# Altium project F4Test2.PrjPcb
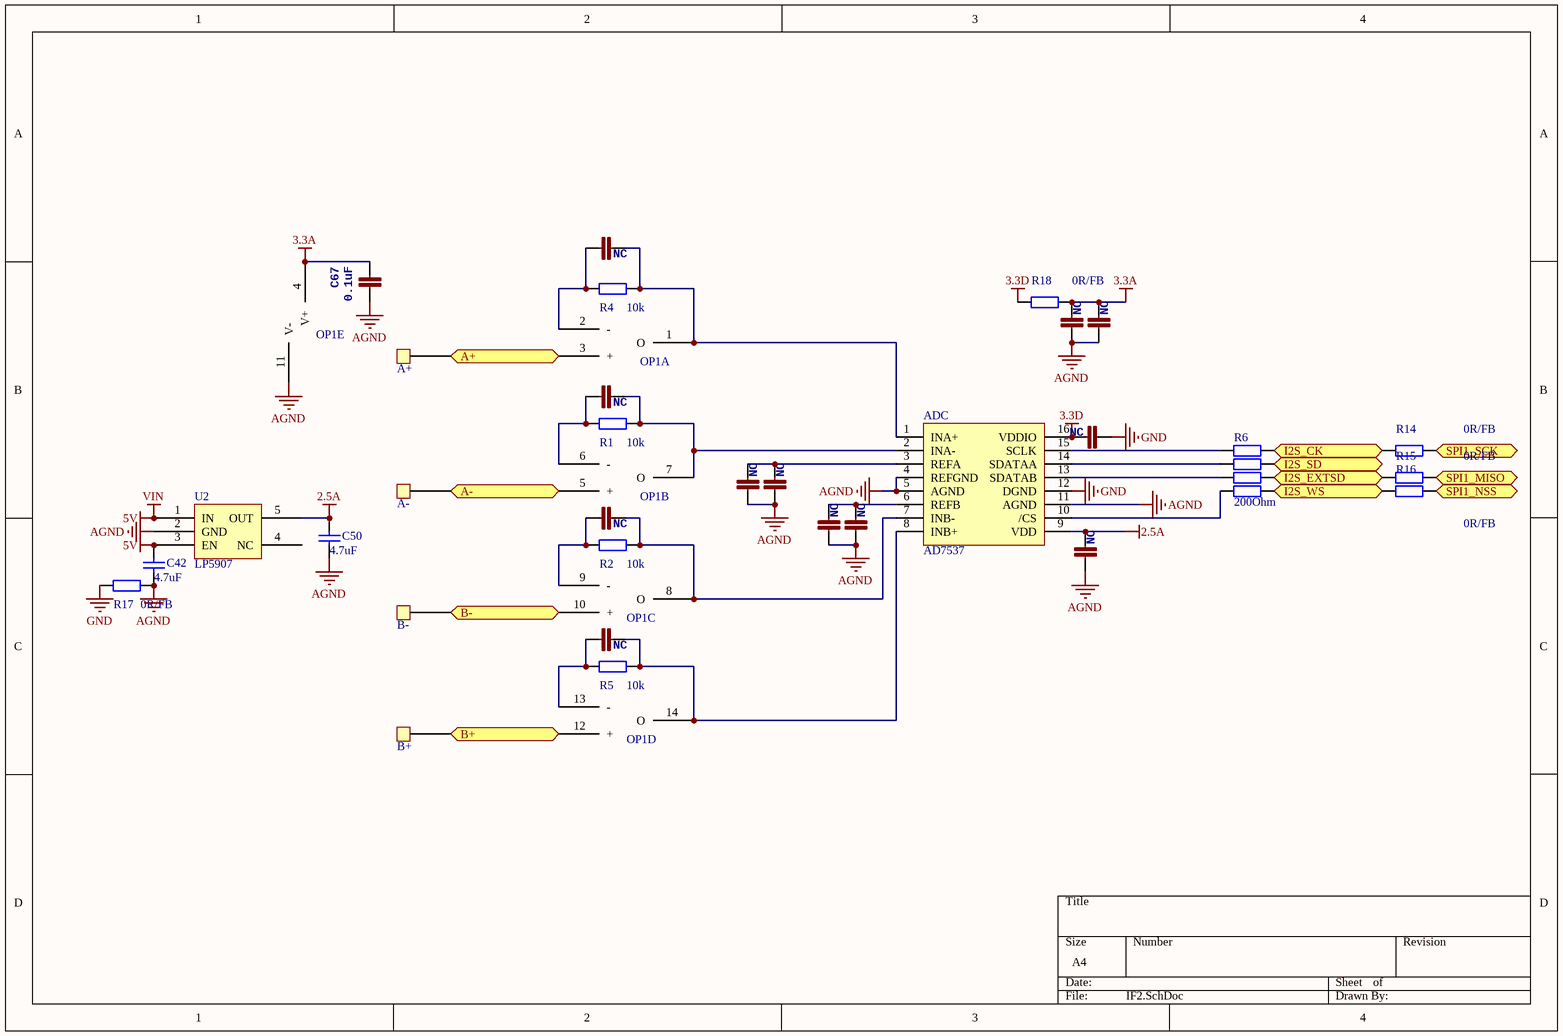
[diagram p0: IF2.SchDoc]
3 sheets, 82 parts. Net scope: flat (ports and power ports of the same name join across sheets).
Board file: F4Test2.PcbDoc
Sheets:
  IF2.SchDoc
  USB_HS2.SchDoc
  mcu3.SchDoc

## Sheet IF2.SchDoc
size A4

### Parts
A+  TestPad  [TestPad - 1mm]  (value not drawn)
A-  TestPad  [TestPad - 1mm]  (value not drawn)
ADC  AD7537  [AD7357]
B+  TestPad  [TestPad - 1mm]  (value not drawn)
B-  TestPad  [TestPad - 1mm]  (value not drawn)
C1  NC  [0402]
C8  NC  [0402]
C9  NC  [0603]
C12  NC  [0805]
C13  NC  [0402]
C14  NC  [0603]
C15  NC  [0805]
C16  NC  [0402]
C29  NC  [0402]
C30  NC  [0603]
C31  NC  [0603]
C32  NC  [0805]
C42  4.7uF  [0603]
C50  4.7uF  [0603]
C67  0.1uF  [0402]
OP1  MCP6024  (value not drawn)  (parts A,B,C,D,E of 5)
R1  10k  [0402]
R2  10k  [0402]
R4  10k  [0402]
R5  10k  [0402]
R6  value 200Ohm  [0402X4]  (hidden comment: Res*4)
R14  0R/FB  [0402]
R15  0R/FB  [0402]
R16  0R/FB  [0402]
R17  0R/FB  [0402]
R18  0R/FB  [0402]
U2  LP5907  [SOT23-5]

### Ports
A+, A-, B+, B-, I2S_CK, I2S_EXTSD, I2S_SD, I2S_WS, SPI1_MISO, SPI1_NSS, SPI1_SCK

### Nets
2.5A: ADC.9(VDD) C30.1 C50.2 U2.5(OUT)
3.3A: C14.1 C15.1 C67.1 OP1.4(V+) R18.1
3.3D: ADC.16(VDDIO) C29.1 R18.2
5V: C42.2 U2.1(IN) U2.3(EN)  [also labelled VIN]
AGND: ADC.4(REFGND) ADC.5(AGND) ADC.11(AGND) C9.2 C12.2 C14.2 C15.2 C30.2 C31.2 C32.2 C42.1 C50.1 C67.2 OP1.11(V-) R17.1 U2.2(GND)
GND: ADC.12(DGND) C29.2 R17.2
NetA+_1: A+.1 OP1.3(+) ; port A+
NetA-_1: A-.1 OP1.5(+) ; port A-
NetADC_1: ADC.1(INA+) C1.1 OP1.1(O) R4.1
NetADC_2: ADC.2(INA-) C8.1 OP1.7(O) R1.1
NetADC_3: ADC.3(REFA) C9.1 C12.1
NetADC_6: ADC.6(REFB) C31.1 C32.1
NetADC_7: ADC.7(INB-) C13.1 OP1.8(O) R2.1
NetADC_8: ADC.8(INB+) C16.1 OP1.14(O) R5.1
NetADC_10: ADC.10(/CS) R6.8
NetADC_13: ADC.13(SDATAB) R6.7
NetADC_14: ADC.14(SDATAA) R6.6
NetADC_15: ADC.15(SCLK) R6.5
NetB+_1: B+.1 OP1.12(+) ; port B+
NetB-_1: B-.1 OP1.10(+) ; port B-
NetC1_2: C1.2 OP1.2(-) R4.2
NetC8_2: C8.2 OP1.6(-) R1.2
NetC13_2: C13.2 OP1.9(-) R2.2
NetC16_2: C16.2 OP1.13(-) R5.2
Netdebug1_2: R14.1 ; port SPI1_SCK
NetMCU1_20: R6.1 R16.2 ; port I2S_WS
NetMCU1_22: R15.1 ; port SPI1_MISO
NetMCU1_50: R16.1 ; port SPI1_NSS
NetMCU1_51: R6.4 R14.2 ; port I2S_CK
NetMCU1_52: R6.2 R15.2 ; port I2S_EXTSD
NetMCU1_53: R6.3 ; port I2S_SD

Not connected (* = marked no-connect by the designer): U2 4(NC)

### Library data of the parts
C1 C8 C9 C12-C16 C29-C32 C67 = CAP0402-CAP: <b>Capacitor</b> / Standard 0603 ceramic capacitor, and 0.1" leaded capacitor.; PARTNO: CC0402ZRY5V7BB104
C42 C50 = Cap: Capacitor; Published: 8-Jun-2000; LatestRevisionDate: 17-Jul-2002; LatestRevisionNote: Re-released for DXP Platform.; PackageReference: RAD-0.3; Publisher: Altium Limited; PackageDescription: Radial Cap, Thru-Hole; 2 Leads; 0.3 in Pin Spacing
OP1 = OP-SOP14
R1 R2 R4 R5 R14-R18 = Res2: Resistor; Value: 0Ohm; Published: 8-Jun-2000; LatestRevisionDate: 17-Jul-2002; LatestRevisionNote: Re-released for DXP Platform.; PackageReference: AXIAL-0.4; Publisher: Altium Limited; PackageDescription: Axial Device, Thru-Hole; 2 Leads; 0.4 in Pin Spacing
R6 = Res*4: Resistor; Published: 8-Jun-2000; LatestRevisionDate: 17-Jul-2002; LatestRevisionNote: Re-released for DXP Platform.; PackageReference: AXIAL-0.4; Publisher: Altium Limited; PackageDescription: Axial Device, Thru-Hole; 2 Leads; 0.4 in Pin Spacing

## Sheet USB_HS2.SchDoc
size A4
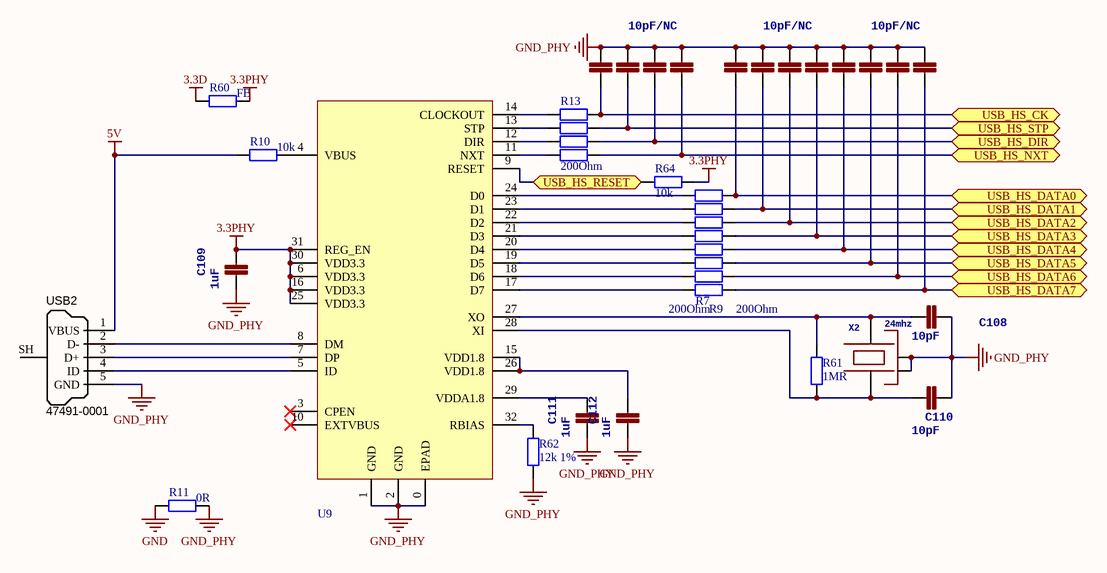
[diagram p1: USB_HS2.SchDoc]

### Parts
C17  10pF/NC  [0402]
C18  1n  [0402]  (value not drawn)
C19  1n  [0402]  (value not drawn)
C20  1n  [0402]  (value not drawn)
C21  10pF/NC  [0402]
C22  1n  [0402]  (value not drawn)
C23  1n  [0402]  (value not drawn)
C24  1n  [0402]  (value not drawn)
C25  10pF/NC  [0402]
C26  1n  [0402]  (value not drawn)
C27  1n  [0402]  (value not drawn)
C28  1n  [0402]  (value not drawn)
C108  10pF  [0402]
C109  1uF  [0402]
C110  10pF  [0402]
C111  1uF  [0402]
C112  1uF  [0402]
R7  value 200Ohm  [0402X4]  (hidden comment: Res*4)
R9  value 200Ohm  [0402X4]  (hidden comment: Res*4)
R10  10k  [0402]
R11  0R  [0603]
R13  value 200Ohm  [0402X4]  (hidden comment: Res*4)
R60  FB  [0603]
R61  1MR  [0402]
R62  12k 1%  [0402]
R64  10k  [0402]
U9  USB3300_1  [USB3300]  (value not drawn)
USB2  Manufacturer Part Number 1: 47491-0001  [MICRO-YZX]  (hidden comment: USB Micro Type B)
X2  24mhz  [OSCILLATOR-3.2X2.5]

### Ports
USB_HS_CK, USB_HS_DATA0, USB_HS_DATA1, USB_HS_DATA2, USB_HS_DATA3, USB_HS_DATA4, USB_HS_DATA5, USB_HS_DATA6, USB_HS_DATA7, USB_HS_DIR, USB_HS_NXT, USB_HS_RESET, USB_HS_STP

### Nets
3.3D: R60.1
3.3PHY: C109.1 R60.2 R64.1 U9.6(VDD3.3) U9.16(VDD3.3) U9.25(VDD3.3) U9.30(VDD3.3) U9.31(REG_EN)
5V: R10.1 USB2.1(VBUS)
GND: R11.1
GND_PHY: C17.2 C18.2 C19.2 C20.2 C21.2 C22.2 C23.2 C24.2 C25.2 C26.2 C27.2 C28.2 C108.1 C109.2 C110.1 C111.2 C112.2 R11.2 R62.1 U9.0(EPAD) U9.1(GND) U9.2(GND) USB2.5(GND) X2.2(NC_2) X2.4(NC_4)
NetC17_1: C17.1 R13.4 ; port USB_HS_CK
NetC18_1: C18.1 R13.3 ; port USB_HS_STP
NetC19_1: C19.1 R13.2 ; port USB_HS_DIR
NetC20_1: C20.1 R13.1 ; port USB_HS_NXT
NetC21_1: C21.1 R9.8 ; port USB_HS_DATA0
NetC22_1: C22.1 R9.7 ; port USB_HS_DATA1
NetC23_1: C23.1 R9.6 ; port USB_HS_DATA2
NetC24_1: C24.1 R9.5 ; port USB_HS_DATA3
NetC25_1: C25.1 R7.8 ; port USB_HS_DATA4
NetC26_1: C26.1 R7.7 ; port USB_HS_DATA5
NetC27_1: C27.1 R7.6 ; port USB_HS_DATA6
NetC28_1: C28.1 R7.5 ; port USB_HS_DATA7
NetC108_2: C108.2 R61.2 U9.27(XO) X2.3
NetC110_2: C110.2 R61.1 U9.28(XI) X2.1
NetC111_1: C111.1 U9.29(VDDA1.8)
NetC112_1: C112.1 U9.15(VDD1.8) U9.26(VDD1.8)
NetMCU1_2: R64.2 U9.9(RESET) ; port USB_HS_RESET
NetR7_1: R7.1 U9.20(D4)
NetR7_2: R7.2 U9.19(D5)
NetR7_3: R7.3 U9.18(D6)
NetR7_4: R7.4 U9.17(D7)
NetR9_1: R9.1 U9.24(D0)
NetR9_2: R9.2 U9.23(D1)
NetR9_3: R9.3 U9.22(D2)
NetR9_4: R9.4 U9.21(D3)
NetR10_2: R10.2 U9.4(VBUS)
NetR13_5: R13.5 U9.14(CLOCKOUT)
NetR13_6: R13.6 U9.13(STP)
NetR13_7: R13.7 U9.12(DIR)
NetR13_8: R13.8 U9.11(NXT)
NetR62_2: R62.2 U9.32(RBIAS)
NetU9_5: U9.5(ID) USB2.4(ID)
NetU9_7: U9.7(DP) USB2.3(D+)
NetU9_8: U9.8(DM) USB2.2(D-)

Not connected (* = marked no-connect by the designer): U9 3(CPEN)* 10(EXTVBUS)*; USB2 SH(Shell)

### Library data of the parts
C17-C28 C108-C112 = CAP0402-CAP: as C1 on sheet IF2
R7 R9 R13 = Res*4: Resistor; Published: 8-Jun-2000; LatestRevisionDate: 17-Jul-2002; LatestRevisionNote: Re-released for DXP Platform.; PackageReference: AXIAL-0.4; Publisher: Altium Limited; PackageDescription: Axial Device, Thru-Hole; 2 Leads; 0.4 in Pin Spacing
R10 R11 R60-R62 R64 = Res2: Resistor; Value: 0Ohm; Published: 8-Jun-2000; LatestRevisionDate: 17-Jul-2002; LatestRevisionNote: Re-released for DXP Platform.; PackageReference: AXIAL-0.4; Publisher: Altium Limited; PackageDescription: Axial Device, Thru-Hole; 2 Leads; 0.4 in Pin Spacing
USB2 = USB_Micro_TypeB: Connector SMD USB Micro Type B middle mount; Manufacturer 1: Molex Inc; SCDType: undef; Package / Case: SMD; Supplier 1: Digi-Key; Supplier Part Number 1: WM17142CT-ND
X2 = OSCILLATOR-3.2X2.5: Crystal Oscillator in 3.2x2.5 SMD

## Sheet mcu3.SchDoc
size A4
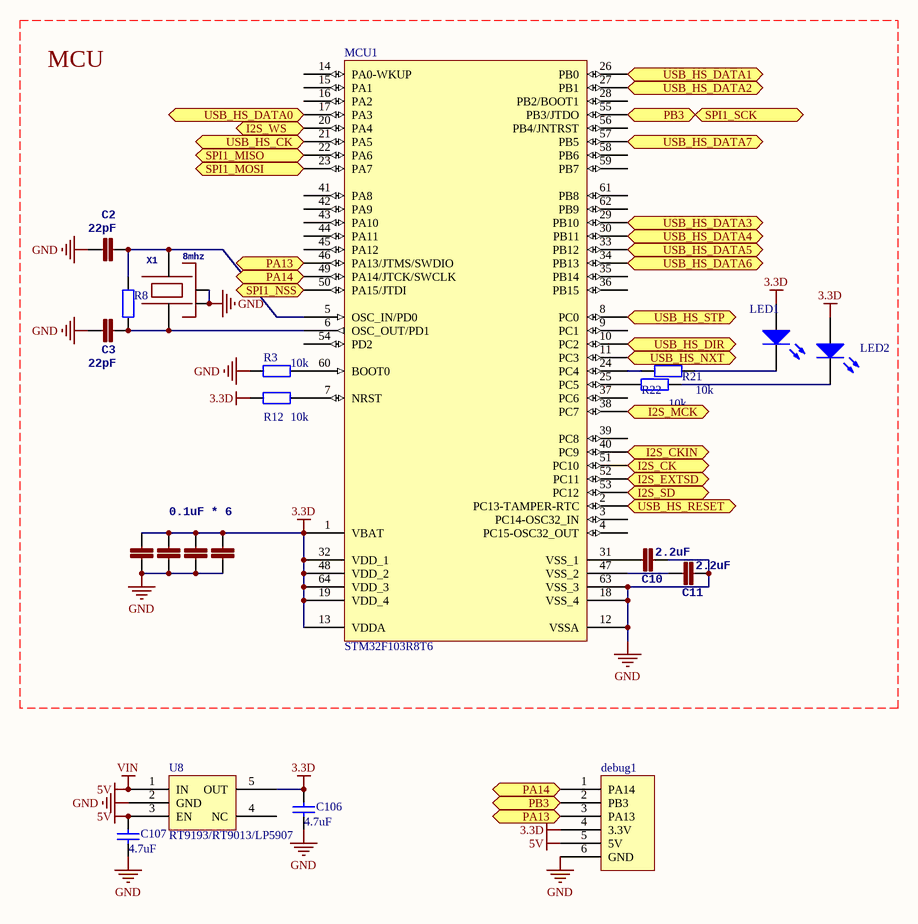
[diagram p2: mcu3.SchDoc]

### Parts
C2  22pF  [0402]
C3  22pF  [0402]
C4  0.1uF * 6  [0402]
C5  1n  [0402]  (value not drawn)
C6  1n  [0402]  (value not drawn)
C7  1n  [0402]  (value not drawn)
C10  2.2uF  [0603]
C11  2.2uF  [0603]
C106  4.7uF  [0603]
C107  4.7uF  [0603]
debug1  debug  [WFRSM125]  (value not drawn)
LED1  LED0  [0603]  (value not drawn)
LED2  LED0  [0603]  (value not drawn)
MCU1  STM32F103R8T6  [LQFP64_N]
R3  10k  [0402]
R8  (no value)  [0402]
R12  10k  [0402]
R21  10k  [0402]
R22  10k  [0402]
U8  RT9193/RT9013/LP5907  [SOT23-5]
X1  8mhz  [OSCILLATOR-3.2X2.5]

### Ports
I2S_CK, I2S_CKIN, I2S_EXTSD, I2S_MCK, I2S_SD, I2S_WS, PA13, PA14, PB3, SPI1_MISO, SPI1_MOSI, SPI1_NSS, SPI1_SCK, USB_HS_CK, USB_HS_DATA0, USB_HS_DATA1, USB_HS_DATA2, USB_HS_DATA3, USB_HS_DATA4, USB_HS_DATA5, USB_HS_DATA6, USB_HS_DATA7, USB_HS_DIR, USB_HS_NXT, USB_HS_RESET, USB_HS_STP

### Nets
3.3D: C4.2 C5.2 C6.2 C7.2 C106.2 debug1.4(3.3V) LED1.1(A) LED2.1(A) MCU1.1(VBAT) MCU1.13(VDDA) MCU1.19(VDD_4) MCU1.32(VDD_1) MCU1.48(VDD_2) MCU1.64(VDD_3) R12.2 U8.5(OUT)
5V: C107.2 debug1.5(5V) U8.1(IN) U8.3(EN)  [also labelled VIN]
GND: C2.2 C3.2 C4.1 C5.1 C6.1 C7.1 C10.2 C11.2 C106.1 C107.1 debug1.6(GND) MCU1.12(VSSA) MCU1.18(VSS_4) MCU1.63(VSS_3) R3.1 U8.2(GND) X1.2(NC_2) X1.4(NC_4)
NetC2_1: C2.1 MCU1.5(OSC_IN/PD0) R8.2 X1.3
NetC3_1: C3.1 MCU1.6(OSC_OUT/PD1) R8.1 X1.1
NetC10_1: C10.1 MCU1.31(VSS_1)
NetC11_1: C11.1 MCU1.47(VSS_2)
NetC17_1: MCU1.21(PA5) ; port USB_HS_CK
NetC18_1: MCU1.8(PC0) ; port USB_HS_STP
NetC19_1: MCU1.10(PC2) ; port USB_HS_DIR
NetC20_1: MCU1.11(PC3) ; port USB_HS_NXT
NetC21_1: MCU1.17(PA3) ; port USB_HS_DATA0
NetC22_1: MCU1.26(PB0) ; port USB_HS_DATA1
NetC23_1: MCU1.27(PB1) ; port USB_HS_DATA2
NetC24_1: MCU1.29(PB10) ; port USB_HS_DATA3
NetC25_1: MCU1.30(PB11) ; port USB_HS_DATA4
NetC26_1: MCU1.33(PB12) ; port USB_HS_DATA5
NetC27_1: MCU1.34(PB13) ; port USB_HS_DATA6
NetC28_1: MCU1.57(PB5) ; port USB_HS_DATA7
Netdebug1_1: debug1.1(PA14) MCU1.49(PA14/JTCK/SWCLK) ; port PA14
Netdebug1_2: debug1.2(PB3) MCU1.55(PB3/JTDO) ; port PB3, port SPI1_SCK
Netdebug1_3: debug1.3(PA13) MCU1.46(PA13/JTMS/SWDIO) ; port PA13
NetLED1_2: LED1.2(K) R21.2
NetLED2_2: LED2.2(K) R22.2
NetMCU1_2: MCU1.2(PC13-TAMPER-RTC) ; port USB_HS_RESET
NetMCU1_7: MCU1.7(NRST) R12.1
NetMCU1_20: MCU1.20(PA4) ; port I2S_WS
NetMCU1_22: MCU1.22(PA6) ; port SPI1_MISO
NetMCU1_23: MCU1.23(PA7) ; port SPI1_MOSI
NetMCU1_24: MCU1.24(PC4) R21.1
NetMCU1_25: MCU1.25(PC5) R22.1
NetMCU1_38: MCU1.38(PC7) ; port I2S_MCK
NetMCU1_40: MCU1.40(PC9) ; port I2S_CKIN
NetMCU1_50: MCU1.50(PA15/JTDI) ; port SPI1_NSS
NetMCU1_51: MCU1.51(PC10) ; port I2S_CK
NetMCU1_52: MCU1.52(PC11) ; port I2S_EXTSD
NetMCU1_53: MCU1.53(PC12) ; port I2S_SD
NetMCU1_60: MCU1.60(BOOT0) R3.2

Not connected (* = marked no-connect by the designer): MCU1 3(PC14-OSC32_IN) 4(PC15-OSC32_OUT) 9(PC1) 14(PA0-WKUP) 15(PA1) 16(PA2) 28(PB2/BOOT1) 35(PB14) 36(PB15) 37(PC6) 39(PC8) 41(PA8) 42(PA9) 43(PA10) 44(PA11) 45(PA12) 54(PD2) 56(PB4/JNTRST) 58(PB6) 59(PB7) 61(PB8) 62(PB9); U8 4(NC)

### Notes on the sheet
- MCU

### Library data of the parts
C2-C7 C10 C11 = CAP0402-CAP: as C1 on sheet IF2
C106 C107 = Cap: Capacitor; Published: 8-Jun-2000; LatestRevisionDate: 17-Jul-2002; LatestRevisionNote: Re-released for DXP Platform.; PackageReference: RAD-0.3; Publisher: Altium Limited; PackageDescription: Radial Cap, Thru-Hole; 2 Leads; 0.3 in Pin Spacing
LED1 LED2 = LED0: Typical INFRARED GaAs LED; Published: 8-Jun-2000; LatestRevisionDate: 08-Jul-2005; LatestRevisionNote: Mech Layer 1 removed.; PackageReference: LED-0; Publisher: Altium Limited; PackageDescription: LED; 2 Leads
MCU1 = STM32F103R8T6: STM32 ARM-based 32-bit MCU with 64 Kbytes Flash, 64-pin LQFP, Industrial Temperature; Published: *; DatasheetVersion: *; PackageVersion: *; PackageReference: *; Publisher: *; PackageDescription: *; ComponentLink1Description: *; ComponentLink1URL: *; ComponentLink2Description: *; ComponentLink2URL: *
R3 R8 R12 R21 R22 = Res2: Resistor; Value: 0Ohm; Published: 8-Jun-2000; LatestRevisionDate: 17-Jul-2002; LatestRevisionNote: Re-released for DXP Platform.; PackageReference: AXIAL-0.4; Publisher: Altium Limited; PackageDescription: Axial Device, Thru-Hole; 2 Leads; 0.4 in Pin Spacing
U8 = LP5907
X1 = OSCILLATOR-3.2X2.5: Crystal Oscillator in 3.2x2.5 SMD

## Nets that join several sheets
3.3D: IF2 (ADC.16 C29.1 R18.2), USB_HS2 (R60.1), mcu3 (16 pins)
5V: IF2 (C42.2 U2.1 U2.3), USB_HS2 (R10.1 USB2.1), mcu3 (C107.2 debug1.5 U8.1 U8.3)
GND: IF2 (ADC.12 C29.2 R17.2), USB_HS2 (R11.1), mcu3 (18 pins)
NetC17_1: USB_HS2 (C17.1 R13.4), mcu3 (MCU1.21)
NetC18_1: USB_HS2 (C18.1 R13.3), mcu3 (MCU1.8)
NetC19_1: USB_HS2 (C19.1 R13.2), mcu3 (MCU1.10)
NetC20_1: USB_HS2 (C20.1 R13.1), mcu3 (MCU1.11)
NetC21_1: USB_HS2 (C21.1 R9.8), mcu3 (MCU1.17)
NetC22_1: USB_HS2 (C22.1 R9.7), mcu3 (MCU1.26)
NetC23_1: USB_HS2 (C23.1 R9.6), mcu3 (MCU1.27)
NetC24_1: USB_HS2 (C24.1 R9.5), mcu3 (MCU1.29)
NetC25_1: USB_HS2 (C25.1 R7.8), mcu3 (MCU1.30)
NetC26_1: USB_HS2 (C26.1 R7.7), mcu3 (MCU1.33)
NetC27_1: USB_HS2 (C27.1 R7.6), mcu3 (MCU1.34)
NetC28_1: USB_HS2 (C28.1 R7.5), mcu3 (MCU1.57)
Netdebug1_2: IF2 (R14.1), mcu3 (debug1.2 MCU1.55)
NetMCU1_2: USB_HS2 (R64.2 U9.9), mcu3 (MCU1.2)
NetMCU1_20: IF2 (R6.1 R16.2), mcu3 (MCU1.20)
NetMCU1_22: IF2 (R15.1), mcu3 (MCU1.22)
NetMCU1_50: IF2 (R16.1), mcu3 (MCU1.50)
NetMCU1_51: IF2 (R6.4 R14.2), mcu3 (MCU1.51)
NetMCU1_52: IF2 (R6.2 R15.2), mcu3 (MCU1.52)
NetMCU1_53: IF2 (R6.3), mcu3 (MCU1.53)